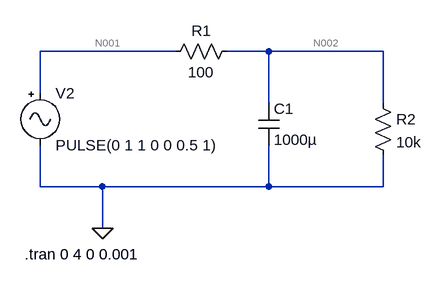
[diagram p0: schematic schemat.asc]
schemat.asc, the LTspice schematic file:
Version 4
SHEET 1 880 680
WIRE 64 -16 -144 -16
WIRE 208 -16 144 -16
WIRE 384 -16 208 -16
WIRE -144 48 -144 -16
WIRE 208 64 208 -16
WIRE 384 64 384 -16
WIRE -144 192 -144 128
WIRE -48 192 -144 192
WIRE 208 192 208 128
WIRE 208 192 -48 192
WIRE 384 192 384 144
WIRE 384 192 208 192
WIRE -48 256 -48 192
FLAG -48 256 0
SYMBOL Misc\\signal -144 32 R0
WINDOW 123 0 0 Left 0
WINDOW 39 0 0 Left 0
SYMATTR InstName V2
SYMATTR Value PULSE(0 1 1 0 0 0.5 1)
SYMBOL res 368 48 R0
SYMATTR InstName R2
SYMATTR Value 10k
SYMBOL res 160 -32 R90
WINDOW 0 0 56 VBottom 2
WINDOW 3 32 56 VTop 2
SYMATTR InstName R1
SYMATTR Value 100
SYMBOL cap 192 64 R0
SYMATTR InstName C1
SYMATTR Value 1000µ
TEXT -168 296 Left 2 !.tran 0 4 0 0.001

The netlist it stands for:
* schemat.asc
V2 N001 0 PULSE(0 1 1 0 0 0.5 1)
R2 N002 0 10k
R1 N002 N001 100
C1 N002 0 1000µ
.tran 0 4 0 0.001
.backanno
.end

* Results of the author's LTspice run, read from the files saved beside the schematic
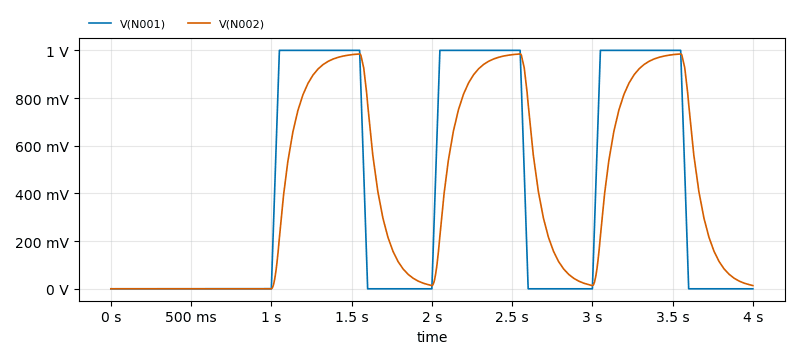
[diagram p1: Transient Analysis of schemat.asc, plotted from the saved traces]
* Transient Analysis, 1 run:
*   V(N001): min 0 V, max 1 V, average 412.5 mV, rms 633 mV, last 0 V
*   V(N002): min 0 V, max 985.2 mV, average 408 mV, rms 575.6 mV, last 13.63 mV